# Altium project Tigresse_experience.PrjPcb
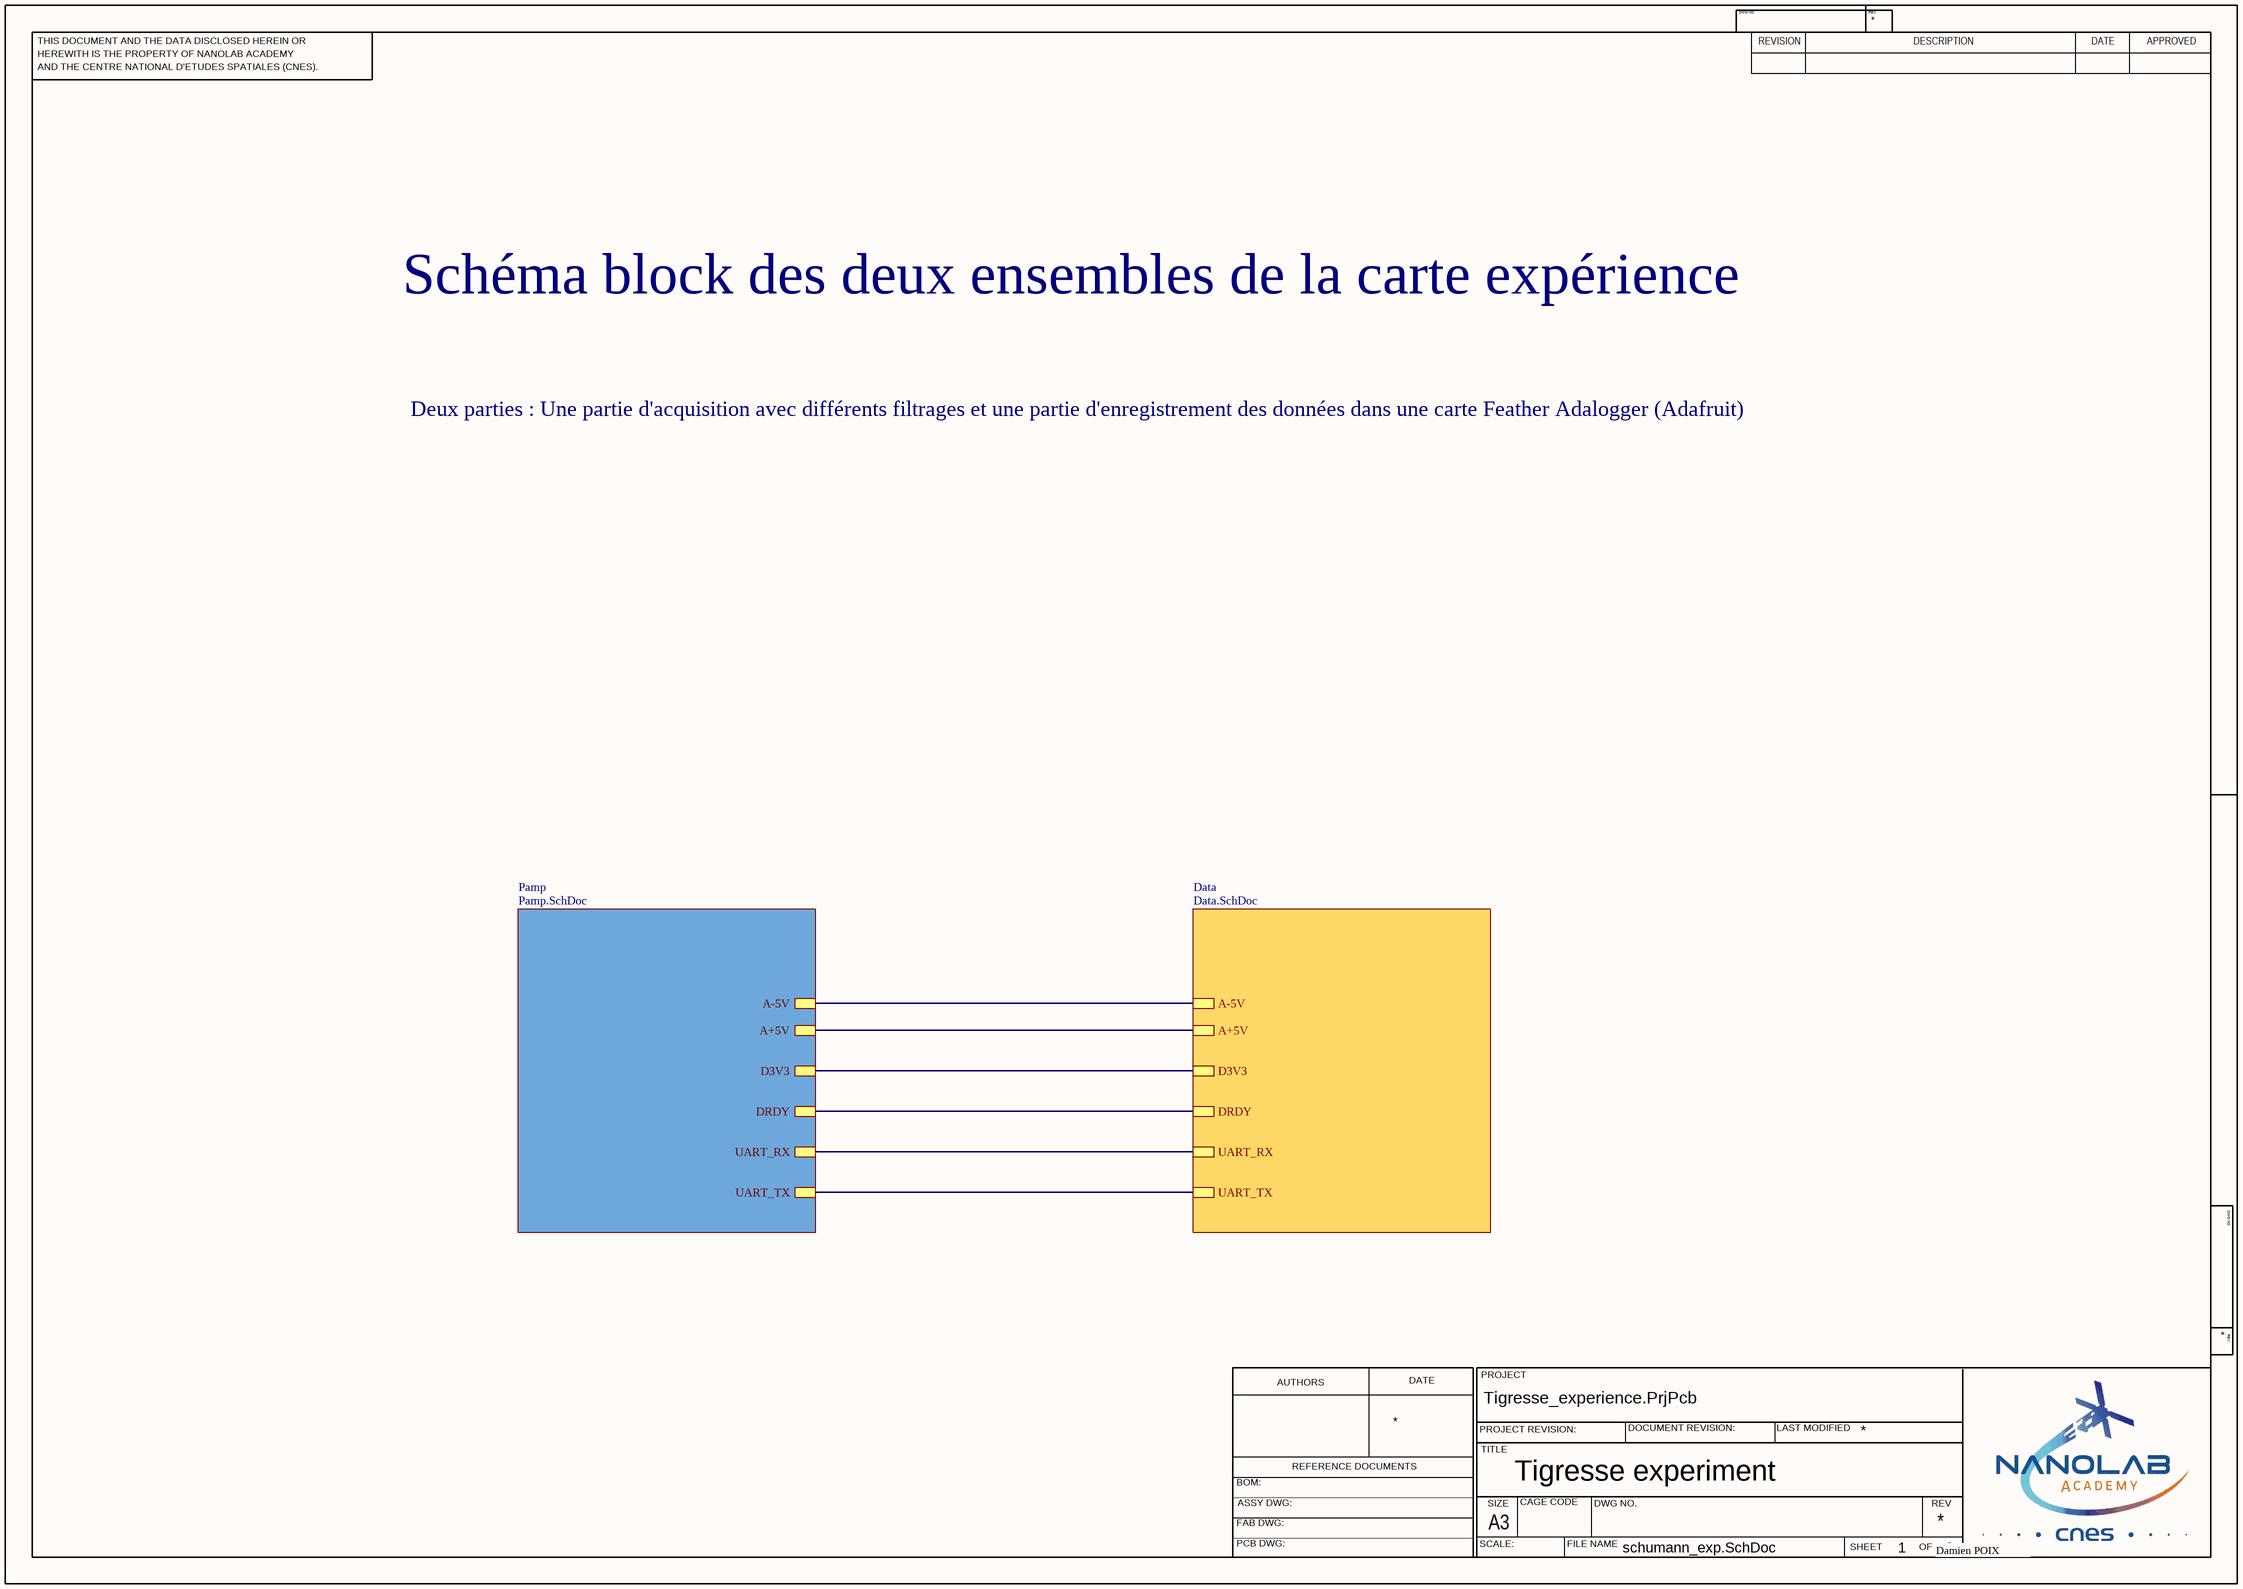
[diagram p0: schumann_exp.SchDoc]
3 sheets, 36 parts. Net scope: hierarchical (ports join the sheet entries above them; power ports are global).
Board file: pcb_tigresse_experiment.PcbDoc
Sheets:
  schumann_exp.SchDoc
    Pamp = Pamp.SchDoc
    Data = Data.SchDoc

## Sheet schumann_exp.SchDoc: Tigresse experiment
size 420 x 297 mm; Author: Damien POIX; CompanyName: Space'Tech Orléans; SheetNumber: 1; SheetTotal: 3

### Sub-sheets
Data = Data.SchDoc: UART_TX, UART_RX, DRDY, D3V3, A+5V, A-5V
Pamp = Pamp.SchDoc: UART_RX, UART_TX, DRDY, D3V3, A+5V, A-5V

### Nets
NetADC_3: sheet Pamp/D3V3, sheet Data/D3V3
NetADC_12: sheet Pamp/A+5V, sheet Data/A+5V
NetADC_14: sheet Pamp/DRDY, sheet Data/DRDY
NetADC_15: sheet Pamp/UART_RX, sheet Data/UART_RX
NetADC_16: sheet Pamp/UART_TX, sheet Data/UART_TX
NetPH2_3: sheet Pamp/A-5V, sheet Data/A-5V

### Notes on the sheet
- Schéma block des deux ensembles de la carte expérience
- Deux parties : Une partie d'acquisition avec différents filtrages et une partie d'enregistrement des données dans une carte Feather Adalogger (Adafruit)
- Damien POIX
- THIS DOCUMENT AND THE DATA DISCLOSED HEREIN OR
- HEREWITH IS THE PROPERTY OF NANOLAB ACADEMY
- DWG NO:
- REVISION
- REV:
- DESCRIPTION
- DATE
- APPROVED
- AND THE CENTRE NATIONAL D'ETUDES SPATIALES (CNES).
- AUTHORS
- PROJECT
- REFERENCE DOCUMENTS
- PROJECT REVISION:
- TITLE
- DOCUMENT REVISION:
- LAST MODIFIED
- BOM:
- FAB DWG:
- PCB DWG:
- ASSY DWG:
- SCALE:
- SIZE
- A3
- CAGE CODE
- FILE NAME
- DWG NO.
- SHEET
- OF
- REV

## Sheet Pamp.SchDoc
size 420 x 297 mm; SheetNumber: 2; SheetTotal: 3
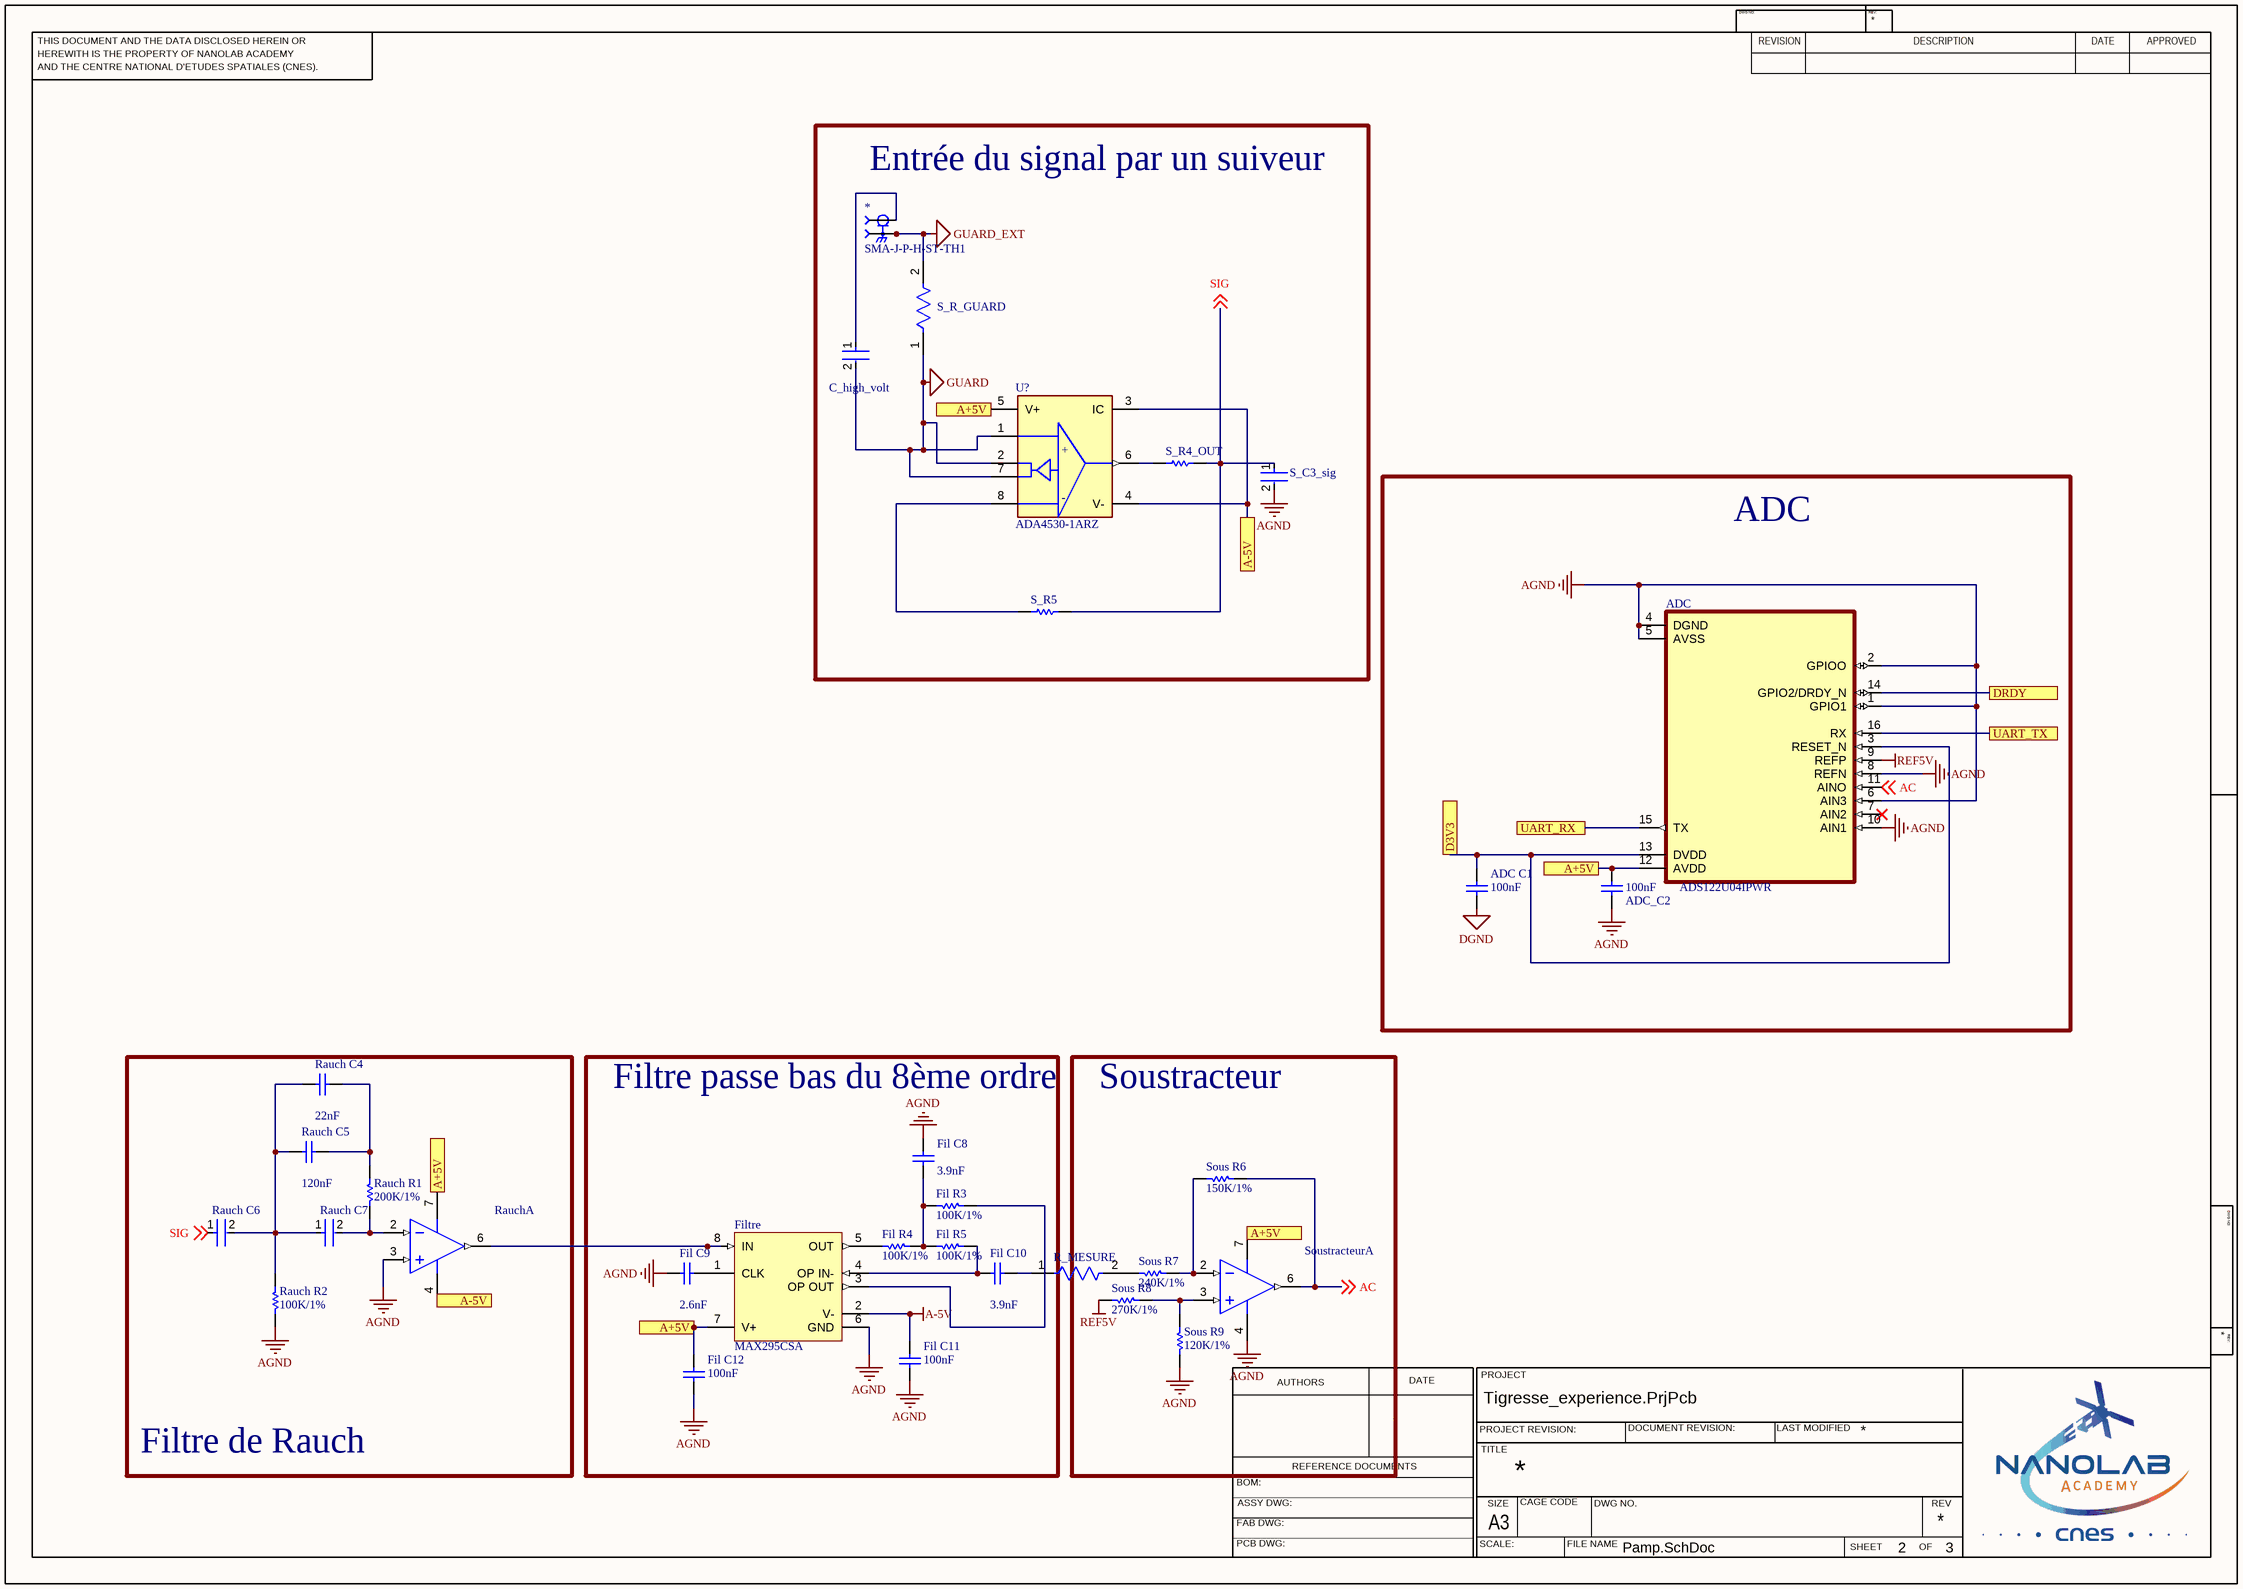
[diagram p1: Pamp.SchDoc]

### Parts
*  SMA-J-P-H-ST-TH1  [SMA-J-P-H-ST-TH1-Footprint-1]
ADC  ADS122U04IPWR  [SOP65P640X120-16N]
ADC_C1  value 100nF  [0603]  (hidden comment: X7R 50V)
ADC_C2  value 100nF  [0603]  (hidden comment: X7R 50V)
C_high_volt  DE2B3SA331KA3BY02F  [FP-DE2_D6_T5_F7_5_d0_6-0-MFG]  (value not drawn)
Fil_C8  value 3.9nF  [1608[0603]]  (hidden comment: NPO/25V)
Fil_C9  value 2.6nF  [1608[0603]]  (hidden comment: NPO/25V)
Fil_C10  value 3.9nF  [1608[0603]]  (hidden comment: NPO/25V)
Fil_C11  value 100nF  [0603]  (hidden comment: X7R 50V)
Fil_C12  value 100nF  [0603]  (hidden comment: X7R 50V)
Fil_R3  value 100K/1%  [0603]
Fil_R4  value 100K/1%  [0603]
Fil_R5  value 100K/1%  [0603]
Filtre  MAX295CSA  [MAXM-S8-5_M]
R_MESURE  CRCW08050000ZSTA  [FP-CRCW0805-MFG]  (value not drawn)
Rauch  AD8641ARZ-REEL7  [ADI-R-8_M]  (value not drawn)  (part A of 2)
Rauch_C4  value 22nF  [0603]  (hidden comment: X7R 16V)
Rauch_C5  value 120nF  [0603]  (hidden comment: X7R 25V)
Rauch_C6  CGA4J3X7T2E104M125AE  [FP-CGA4J-IPC_C]  (value not drawn)
Rauch_C7  CGA8P3X7T2E105K250KA  [FP-CGA8R-IPC_B]  (value not drawn)
Rauch_R1  value 200K/1%  [0603]
Rauch_R2  value 100K/1%  [0603]
S_C3_sig  CL31C221JGFNNNF  [FP-CL31-IPC_C]  (value not drawn)
S_R4_OUT  CRCW08051K00FKEA  [RESC2013X50X30NL20T20]  (value not drawn)
S_R5  ERJ-6ENF1500V  [RESC2013X70X40LL20T20]  (value not drawn)
S_R_GUARD  CRCW0805100KFKEA  [FP-CRCW0805-e3-MFG]  (value not drawn)
Sous_R6  value 150K/1%  [0603]
Sous_R7  value 240K/1%  [0603]
Sous_R8  value 270K/1%  [0603]
Sous_R9  value 120K/1%  [0603]
Soustracteur  AD8641ARZ-REEL7  [ADI-R-8_M]  (value not drawn)  (part A of 2)
U?  ADA4530-1ARZ  [FP-R-8-IPC_C]

### Blocks framed on the sheet
Entrée du signal par un suiveur: * C_high_volt S_C3_sig S_R4_OUT S_R5 S_R_GUARD U?
ADC: ADC ADC_C1 ADC_C2
Filtre de Rauch: Rauch Rauch_C4-Rauch_C7 Rauch_R1 Rauch_R2
Filtre passe bas du 8ème ordre: Fil_C8-Fil_C12 Fil_R3-Fil_R5 Filtre
Soustracteur: R_MESURE Sous_R6-Sous_R9 Soustracteur

### Ports
A+5V, A-5V, D3V3, DRDY, UART_RX, UART_TX

### Nets
A-5V: Fil_C11.2 Filtre.2(V-)
AGND: ADC.1(GPIO1) ADC.2(GPIOO) ADC.4(DGND) ADC.5(AVSS) ADC.6(AIN3) ADC.8(REFN) ADC.10(AIN1) ADC_C2.1 Fil_C8.1 Fil_C9.2 Fil_C11.1 Fil_C12.1 Filtre.6(GND) Rauch.3(+IN) Rauch_R2.1 S_C3_sig.2 Sous_R9.2 Soustracteur.4(VEE)
DGND: ADC_C1.1
GUARD: C_high_volt.2 S_R_GUARD.1 U?.1(+IN) U?.2(GRD) U?.7(GRD)
GUARD_EXT: *.2 *.3 *.4 *.5 S_R_GUARD.2
REF5V: ADC.9(REFP) Sous_R8.2
AC: ADC.11(AINO) Sous_R6.2 Soustracteur.6(OUT) ; off-sheet AC
SIG: Rauch_C6.1 S_C3_sig.1 S_R4_OUT.2 S_R5.2 ; off-sheet SIG
Net*_1: *.1 C_high_volt.1
NetADC_3: ADC.3(RESET_N) ADC.13(DVDD) ADC_C1.2 ; port D3V3
NetADC_12: ADC.12(AVDD) ADC_C2.2 Fil_C12.2 Filtre.7(V+) Rauch.7(VCC) Soustracteur.7(VCC) U?.5(V+) ; port A+5V
NetADC_14: ADC.14(GPIO2/DRDY_N) ; port DRDY
NetADC_15: ADC.15(TX) ; port UART_RX
NetADC_16: ADC.16(RX) ; port UART_TX
NetFil_C8_2: Fil_C8.2 Fil_R3.2 Fil_R4.2 Fil_R5.2
NetFil_C9_1: Fil_C9.1 Filtre.1(CLK)
NetFil_C10_1: Fil_C10.1 Fil_R5.1 Filtre.4(OP_IN-)
NetFil_C10_2: Fil_C10.2 R_MESURE.1
NetFil_R3_1: Fil_R3.1 Filtre.3(OP_OUT)
NetFil_R4_1: Fil_R4.1 Filtre.5(OUT)
NetFiltre_8: Filtre.8(IN) Rauch.6(OUT)
NetPH2_3: Rauch.4(VEE) U?.3(IC) U?.4(V-) ; port A-5V
NetR_MESURE_2: R_MESURE.2 Sous_R7.2
NetRauch_2: Rauch.2(-IN) Rauch_C7.2 Rauch_R1.1
NetRauch_C4_1: Rauch_C4.1 Rauch_C5.1 Rauch_R1.2
NetRauch_C4_2: Rauch_C4.2 Rauch_C5.2 Rauch_C6.2 Rauch_C7.1 Rauch_R2.2
NetS_R4_OUT_1: S_R4_OUT.1 U?.6(OUT)
NetS_R5_1: S_R5.1 U?.8(-IN)
NetSous_R6_1: Sous_R6.1 Sous_R7.1 Soustracteur.2(-IN)
NetSous_R8_1: Sous_R8.1 Sous_R9.1 Soustracteur.3(+IN)

Not connected (* = marked no-connect by the designer): ADC 7(AIN2)*

### Notes on the sheet
- THIS DOCUMENT AND THE DATA DISCLOSED HEREIN OR
- HEREWITH IS THE PROPERTY OF NANOLAB ACADEMY
- DWG NO:
- REVISION
- REV:
- DESCRIPTION
- DATE
- APPROVED
- AND THE CENTRE NATIONAL D'ETUDES SPATIALES (CNES).
- AUTHORS
- PROJECT
- REFERENCE DOCUMENTS
- PROJECT REVISION:
- TITLE
- DOCUMENT REVISION:
- LAST MODIFIED
- BOM:
- FAB DWG:
- PCB DWG:
- ASSY DWG:
- SCALE:
- SIZE
- A3
- CAGE CODE
- FILE NAME
- DWG NO.
- SHEET
- OF
- REV
- (in symbol CMP-09116-000005-1) +; -

### Library data of the parts
* = CMP-002-00112-1: Conn SMA 0Hz to 20GHz 50Ohm Solder ST Thru-Hole F Gold Tray
ADC_C1 ADC_C2 Fil_C11 Fil_C12 Rauch_C4 Rauch_C5 = Cap CMS: Capacitor (Semiconductor SIM Model); Published: 8-Jun-2000; LatestRevisionDate: 29-May-2009; LatestRevisionNote: IPC-7351 Footprint Added.; PackageReference: C1206; Publisher: Altium Limited; PackageDescription: Chip Capacitor
C_high_volt = CMP-06035-062106-1: Cap Ceramic Disc 330pF 10% 400VAC Thru-Hole 6.0x5.0x7.5 Bulk
Fil_C8-Fil_C10 = Cap Semi: Capacitor (Semiconductor SIM Model); Published: 8-Jun-2000; LatestRevisionDate: 29-May-2009; LatestRevisionNote: IPC-7351 Footprint Added.; PackageReference: C1206; Publisher: Altium Limited; PackageDescription: Chip Capacitor
Fil_R3-Fil_R5 Rauch_R1 Rauch_R2 Sous_R6-Sous_R9 = Res CMS: Resistor; Published: 8-Jun-2000; LatestRevisionDate: 17-Jul-2002; LatestRevisionNote: Re-released for DXP Platform.; PackageReference: AXIAL-0.3; Publisher: Altium Limited; PackageDescription: Axial Device, Thru-Hole; 2 Leads; 0.3 in Pin Spacing
Filtre = CMP-0026-00196-2: 8th-Order Switched Capacitor Lowpass Filter, Butterworth, Clock Tunable, 0 to 70 degC, 8-Pin SOIC (S8-5); Generic Part Number: MAX295; Filter Sections: 1; Order Per Filter Section: 8; ComponentLink3URL: http://pdfserv.maximintegrated.com/package_dwgs/21-0041.PDF; Filter Characteristic: Butterworth; DatasheetVersion: Rev. 5; Code_JEDEC: MS012; ComponentLink3Description: Package Specification; ComponentLink2URL: http://datasheets.maximintegrated.com/en/ds/MAX291-MAX296.pdf; ComponentLink1URL: http://www.maximintegrated.com/; Mounting Technology: Surface Mount; PartNumber: MAX295CSA; PackageReference: S8-5; Filter Class: Switched Cap; PackageDescription: 8-Pin Small-Outline IC, Narrow (0.15in) (S8-5), Body 4.90 x 3.90 mm, Pitch 1.27 mm; Filter Type: Lowpass; ComponentLink1Description: Manufacturer URL; PackageVersion: Rev. D, 10/2012; Program Method: Clock; ComponentLink2Description: Datasheet
R_MESURE = CMP-2001-04898-2: RES SMD 0 OHM JUMPER 1/8W 0805; Tolerance: 1%; Voltage Rating: 150V; Power Rating: 125mW; Temperature Coefficient: 100ppm/°C; Resistance: 0R; Series: CRCW; Features: Automotive AEC-Q200; Mount: Surface Mount; Depth: 1.25mm; Max Operating Temperature: 155°C; Case/Package: 0805; Packaging: Tape and Reel; Case Code (Metric): 2012; Height: 0.02inch; Package Quantity: 5000; Weight: 0.000194oz; Radiation Hardening: No; Military Standard: Not; Lead Free: Contains Lead; Construction: Rectangular; Voltage Rating (DC): 150V; Length: 2mm; Case Code (Imperial): 0805; Width: 0.049inch; Min Operating Temperature: -55°C; Number of Terminations: 2; Power Dissipation: 125mW; Max Power Dissipation: 125mW; RoHS Compliant: No; Contact Plating: Tin; Termination: SMD/SMT; Resistor Type: Thick Film
Rauch Soustracteur = CMP-0384-00603-2: Single Channel Very Low Input Bias Current Operational Amplifier, 3 MHz BW, 2 V/us SR, Industrial, 8-pin SOIC (R-8), Reel; Manufacturer: Analog Devices; Generic Part Number: AD8641; Small Signal Bandwidth: 3MHz; Slew Rate: 2V/us; V Span Min: 5V; Amplifiers Per Package: 1; Iq/Amp: 250ÂµA; V Span Max: 26V; Input Offset Voltage: 50uV; Input Bias Current: 250fA; ComponentLink1Description: Manufacturer URL; PackageDescription: 8-Pin Standard Small Outline Package, Body 3.9 x 4.9 mm, Pitch 1.27 mm; DatasheetVersion: Rev. E; ComponentLink3Description: Package Specification; PackageVersion: 060506-A; ComponentLink2URL: http://www.analog.com/static/imported-files/data_sheets/AD8641_8642_8643.pdf; ComponentLink4Description: Reference Circuit; Code_JEDEC: MS-012-AA; RevisionNote: Reference Circuit URL fixed; Mounting Technology: Surface Mount; ComponentLink2Description: Datasheet; PartNumber: AD8641ARZ-REEL7; ComponentLink3URL: http://www.analog.com/static/imported-files/packages/PKG_PDF/SOIC_Narrow%20(R)/R_8.pdf; ComponentLink4URL: http://www.analog.com/en/all-operational-amplifiers-op-amps/operational-amplifiers-op-amps/ad8641/products/product.html#product-recommendations; PackageReference: R-8; ComponentLink1URL: http://www.analog.com/en/index.html
Rauch_C6 = CMP-08246-000150-1: Cap Ceramic 100nF 250V X7T 20% Pad SMD 0805 +125°C Automotive T/R; Mount: Surface Mount; Weight: 0.000194oz; Features: Soft Termination; Package Quantity: 1; Termination: SMD/SMT; Length: 2mm; REACH SVHC: No SVHC; Radiation Hardening: No; Min Operating Temperature: -55°C; Capacitance: 100nF; Packaging: Tape and Reel; Ratings: AEC-Q200; Dielectric: X7T; Case Code (Metric): 2012; Depth: 1.25mm; Case Code (Imperial): 0805; Max Operating Temperature: 125°C; Width: 0.049inch; Thickness: 0.049inch; Case/Package: 0805; Voltage Rating: 250V; Height: 1.25mm; Voltage Rating (DC): 250V; Tolerance: 20%
Rauch_C7 = CMP-08246-002426-1: Cap Ceramic 1uF 250V X7T 10% Pad SMD 1812 +125°C Automotive T/R; Width: 0.126inch; Length: 4.5mm; Thickness: 0.098inch; Depth: 3.2mm; Tolerance: 10%; Max Operating Temperature: 125°C; Dielectric: X7T; Case/Package: 1812; Packaging: Tape and Reel; Mount: Surface Mount; Termination: SMD/SMT; Case Code (Metric): 4532; Package Quantity: 1; Voltage Rating: 250V; Case Code (Imperial): 1812; Min Operating Temperature: -55°C; Ratings: AEC-Q200; Composition: Ceramic; REACH SVHC: No SVHC; Height: 2.5mm; Voltage Rating (DC): 250V; Capacitance: 1uF; Weight: 0.000952oz
S_C3_sig = CMP-13271-001211-1: Cap Ceramic 220pF 500V C0G ±5% SMD 1206 +125°C Embossed T/R; Tolerance: 5%; Voltage Rating (DC): 500V; Depth: 1.6mm; Capacitance: 220pF; Max Operating Temperature: 125°C; Width: 0.063inch; Radiation Hardening: No; Thickness: 0.055inch; Packaging: Tape and Reel; Height: 1.25mm; Case/Package: 1206; Package Quantity: 10000; Dielectric: C0G; Mount: Surface Mount; Voltage Rating: 500V; Min Operating Temperature: -55°C; Length: 3.2mm
S_R4_OUT = CMP-1013-00510-2: Manufacturer: Vishay Dale; Part Number: CRCW08051K00FKEA
S_R5 = CMP-2001-04437-1: Manufacturer: Panasonic; Part Number: ERJ-6ENF1500V
S_R_GUARD = CMP-2001-04899-2: RES Thick Film, 100kΩ, 1%, 0.125W, 100ppm/°C, 0805; Resistance: 100kR; Power Rating: 125mW; Voltage Rating: 150V; Case/Package: 0805; Max Operating Temperature: 155°C; Case Code (Imperial): 0805; Lead Free: Lead Free; Weight: 0.000194oz; Number of Pins: 2; Package Quantity: 5000; Height: 0.45mm; Composition: Thick Film; Military Standard: Not; Tolerance: 1%; Case Code (Metric): 2012; Termination: SMD/SMT; Mount: Surface Mount; Radiation Hardening: No; Width: 1.25mm; Length: 2mm; Depth: 1.25mm; Packaging: Tape and Reel; Min Operating Temperature: -55°C; Contact Plating: Tin; Temperature Coefficient: 100ppm/°C; Voltage Rating (DC): 150V
U? = CMP-09116-000005-1: IC OPAMP GP 1 CIRCUIT 8SOIC; Manufacturer: Analog Devices; Input Offset Voltage: 0.008mV; Max Dual Supply Voltage: 8V; Min Dual Supply Voltage: 2.25V; Max Junction Temp: 150°C; Nominal Supply Current: 0.9mA; Standoff Height: 0.1mm; Max Supply Voltage: 16V; Input Bias Current: 0.00000002uA; Min Supply Voltage: 4.5V; Voltage Gain: 143/150/155dB; Output Current Per Channel: -30mA; Gain Bandwidth: 2MHz; Description: General Purpose Amplifier 1 Circuit Rail-to-Rail 8-SOIC; Number Of Channels: 1; Temperature Range High: +125°C; Device Class L1: Integrated Circuits (ICs); Manufacturer Part Number: ADA4530-1ARZ; Digikey Description: IC OPAMP GP 1 CIRCUIT 8SOIC; Lead Free: Yes; ComponentLink2URL: https://www.analog.com/media/en/technical-documentation/data-sheets/ADA4530-1.pdf; Mouser Description: Instrumentation Amplifiers Ultra low input bias current 16V prec; Octopart: https://octopart.com/ada4530-1arz-analog+devices-64887651; Package: R-8; Height: 1.75mm; Device Class L2: Linear ICs; Temperature Range Low: -40°C; Device Class L3: Instrumentation; Category: IC; Temperature: -40°C to +125°C; Automotive: No; RoHS: TRUE; ComponentLink2Description: Datasheet; Ipc Land Pattern Name: SOIC127P600X155-8
ADC = ADS122U04IPWR: Package: None; Price: None; Value: *; MP: ADS122U04IPWR; Availability: Unavailable

## Sheet Data.SchDoc: Part Data - Schumann experiment
size 420 x 297 mm; Author: Damien POIX; CompanyName: Space'Tech Orléans; SheetNumber: 3; SheetTotal: 3
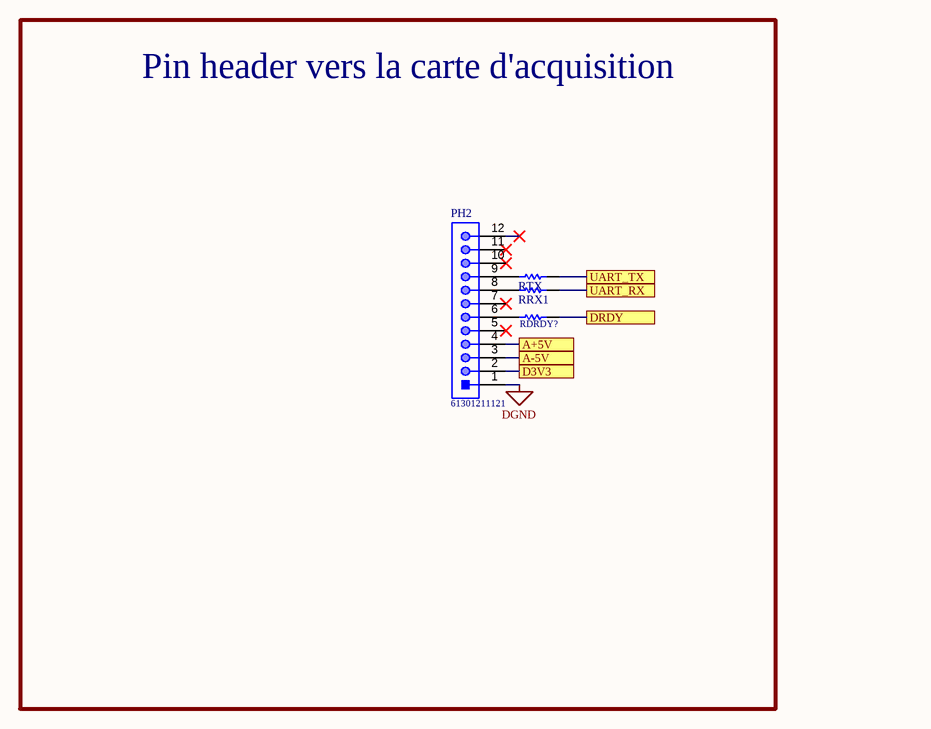
[diagram p2: Data.SchDoc]

### Parts
PH2  61301211121  [61301211121]
RDRDY?  ERA6AEB473V  [RESC2013X60X40ML20T25]  (value not drawn)
RRX1  ERA6AEB473V  [RESC2013X60X40ML20T25]  (value not drawn)
RTX  ERA6AEB473V  [RESC2013X60X40ML20T25]  (value not drawn)

### Blocks framed on the sheet
Pin header vers la carte d'acquisition: PH2 RDRDY? RRX1 RTX

### Ports
A+5V, A-5V, D3V3, DRDY, UART_RX, UART_TX

### Nets
DGND: PH2.1
NetADC_3: PH2.2 ; port D3V3
NetADC_12: PH2.4 ; port A+5V
NetADC_14: RDRDY?.2 ; port DRDY
NetADC_15: RRX1.2 ; port UART_RX
NetADC_16: RTX.2 ; port UART_TX
NetPH2_3: PH2.3 ; port A-5V
NetPH2_6: PH2.6 RDRDY?.1
NetPH2_8: PH2.8 RRX1.1
NetPH2_9: PH2.9 RTX.1

Not connected (* = marked no-connect by the designer): PH2 5* 7* 10* 11* 12*

### Notes on the sheet
- THIS DOCUMENT AND THE DATA DISCLOSED HEREIN OR
- HEREWITH IS THE PROPERTY OF NANOLAB ACADEMY
- DWG NO:
- REVISION
- REV:
- DESCRIPTION
- DATE
- APPROVED
- AND THE CENTRE NATIONAL D'ETUDES SPATIALES (CNES).
- AUTHORS
- PROJECT
- REFERENCE DOCUMENTS
- PROJECT REVISION:
- TITLE
- DOCUMENT REVISION:
- LAST MODIFIED
- BOM:
- FAB DWG:
- PCB DWG:
- ASSY DWG:
- SCALE:
- SIZE
- A3
- CAGE CODE
- FILE NAME
- DWG NO.
- SHEET
- OF
- REV

### Library data of the parts
PH2 = CMP-1502-01086-1: THT Vertical Pin Header WR-PHD, Pitch 2.54 mm, Single Row, 12 pins; Manufacturer: Wurth Elektronik; Pin Number: 12; Gender: Male; Working Voltage: 250VAC; Rated Current: 3A; Withstanding Voltage: 500VAC; Pitch: 2.54mm; Contact Resistance: 20mOhm; Orientation: Vertical; Package Reference: 61301211121; Packaging: Bag; Operating Temperature: -40to105degC; Mounting Technology: THT; Part Number: 61301211121; Manufacturer URL: http://www.we-online.de; Row Number: Single; Publisher: WurthElektronik; Datasheet URL: https://katalog.we-online.de/em/datasheet/6130xx11121.pdf
RDRDY? RRX1 RTX = CMP-2001-00645-1: Manufacturer: Panasonic; Part Number: ERA6AEB473V

## Nets that join several sheets
DGND: Pamp (ADC_C1.1), Data (PH2.1)
NetADC_3: Pamp (ADC.3 ADC.13 ADC_C1.2), Data (PH2.2)
NetADC_12: Pamp (7 pins), Data (PH2.4)
NetADC_14: Pamp (ADC.14), Data (RDRDY?.2)
NetADC_15: Pamp (ADC.15), Data (RRX1.2)
NetADC_16: Pamp (ADC.16), Data (RTX.2)
NetPH2_3: Pamp (Rauch.4 U?.3 U?.4), Data (PH2.3)